# Altium schematic sheet OLED.SchDoc
size 209 x 148 mm
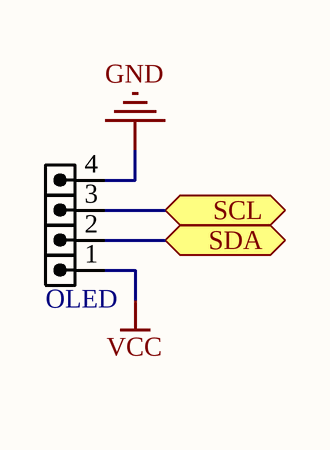
[diagram p0: OLED.SchDoc]

## Parts
OLED  HDR4  [HDR1SE_M_1X4]  (value not drawn)

## Ports
SCL (bidir), SDA (bidir)

## Nets
GND: OLED.4
VCC: OLED.1
SCL: OLED.3 ; port SCL
SDA: OLED.2 ; port SDA

## Library data of the parts
OLED = HDRTST_1X4: HEADER, 1mm pitch, test, SMD; VALUE: HDR4